# Altium schematic sheet GYRO 3-AXIS - ITG-3200.SchDoc
size A4; Organization: Altium Limited; Address1: 3 Minna Close; Address2: Belrose; Address3: NSW 2085; Address4: Australia
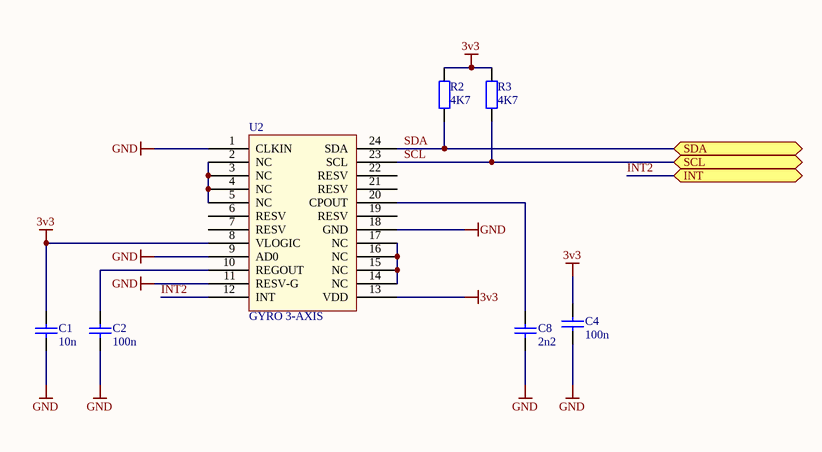
[diagram p0: GYRO 3-AXIS - ITG-3200.SchDoc]

## Parts
C1  10n  [C0805]
C2  100n  [C0805]
C4  100n  [C0805]
C8  2n2  [C0805]
R2  value 4K7  [R0805]  (hidden comment: RESISTOR)
R3  value 4K7  [R0805]  (hidden comment: RESISTOR)
U2  GYRO 3-AXIS  [QFN50P400X400-24V2M - GYRO 3axis]

## Ports
INT (bidir), SCL (bidir), SDA (bidir)

## Nets
3v3: C1.2 C4.2 R2.1 R3.1 U2.8(VLOGIC) U2.13(VDD)
GND: C1.1 C2.1 C4.1 C8.1 U2.1(CLKIN) U2.9(AD0) U2.11(RESV-G) U2.18(GND)
INT2: U2.12(INT) ; port INT
SCL: R3.2 U2.23(SCL) ; port SCL
SDA: R2.2 U2.24(SDA) ; port SDA
NetC2_2: C2.2 U2.10(REGOUT)
NetC8_2: C8.2 U2.20(CPOUT)
NetU2_2: U2.2(NC) U2.3(NC) U2.4(NC) U2.5(NC)
NetU2_14: U2.14(NC) U2.15(NC) U2.16(NC) U2.17(NC)

Not connected (* = marked no-connect by the designer): U2 6(RESV) 7(RESV) 19(RESV) 21(RESV) 22(RESV)

## Notes on the sheet
- Title
- Size:
- Date:
- A4
- Name:
- Time:
- Ing. W. Pietersz
- Revision:
- Sheet
- of
- WillyPietersz@gmail.com
- Contact:
- info@unique-system.nl
- Unique System Elektronics
- Biesboschhaven noord 1-b
- 4251 NL Werkendam
- Netherlands
- www.unique-system.nl
- File:

## Library data of the parts
C1 = 10n: Tolerance: 0.1; LatestRevision Note: Initial Release; Part Number: 10n; Value: 10n; Package: 0805; Component Type: Standard; LatestRevision Date: 31-7-2010; Author: Willy Pietersz; ComponentLink1Description: Manufacturer; ComponentLink2Description: Datasheet
C2 C4 = 100n: Tolerance: 0.1; LatestRevision Note: Initial Release; Part Number: 100n; Value: 100n; Package: 0805; Component Type: Standard; LatestRevision Date: 31-7-2010; Author: Willy Pietersz; Supplier 2: Farnell; Supplier Part Number 2: 1759266; ComponentLink1Description: Manufacturer; ComponentLink2Description: Datasheet
C8 = 2n2: Tolerance: 0.1; LatestRevision Note: Initial Release; Part Number: 2n2; Value: 2n2; Package: 0805; Component Type: Standard; LatestRevision Date: 31-7-2010; Author: Willy Pietersz; ComponentLink1Description: Manufacturer; ComponentLink2Description: Datasheet
R2 R3 = 4K7: Manufacturer 1: Panasonic; Manufacturer 1 Part No: ERJT06J472V; Power: 0.25W; Tolerance: 0.05; LatestRevision Note: Initial Release; Published: 8-Jun-2000; LatestRevisionDate: 17-Jul-2002; LatestRevisionNote: Re-released for DXP Platform.; PackageReference: AXIAL-0.4; Publisher: Altium Limited; Part Number: 4K7; Type: Film; Package: 0805; Component Type: Standard; LatestRevision Date: 30-7-2010; Author: Willy Pietersz; ROHS: Y; Supplier 2: Farnell; Supplier Part Number 2: 1577368; ComponentLink1Description: Manufacturer; ComponentLink2Description: Datasheet
U2 = ITG-3200: Gyro, 3-axis; Part Number: ITG-3200; Component Type: Sensor; Supplier 1: Sparkfun; Supplier Part Number 1: ITG-3200; ComponentLink1Description: Datasheet; ComponentLink1URL: http://www.sparkfun.com/datasheets/Sensors/Gyro/PS-ITG-3200-00-01.4.pdf